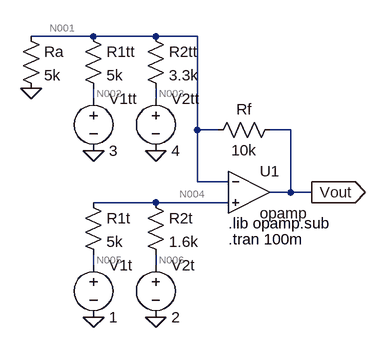
[diagram p0: schematic opamp_alg2.asc]
opamp_alg2.asc, the LTspice schematic file:
Version 4.1
SHEET 1 880 680
WIRE -32 -64 -128 -64
WIRE 64 -64 -32 -64
WIRE 128 -64 64 -64
WIRE -32 32 -32 16
WIRE 64 32 64 16
WIRE 128 80 128 -64
WIRE 160 80 128 80
WIRE 272 80 240 80
WIRE 128 160 128 80
WIRE 176 160 128 160
WIRE 272 176 272 80
WIRE 272 176 240 176
WIRE 304 176 272 176
WIRE 64 192 -32 192
WIRE 176 192 64 192
WIRE -32 288 -32 272
WIRE 64 288 64 272
FLAG 304 176 Vout
IOPIN 304 176 Out
FLAG -32 368 0
FLAG 64 368 0
FLAG -32 112 0
FLAG 64 112 0
FLAG -128 16 0
SYMBOL OpAmps\\opamp 208 112 R0
SYMATTR InstName U1
SYMBOL res 256 64 R90
WINDOW 0 0 56 VBottom 2
WINDOW 3 32 56 VTop 2
SYMATTR InstName Rf
SYMATTR Value 10k
SYMBOL res 48 -80 R0
SYMATTR InstName R2tt
SYMATTR Value 3.3k
SYMBOL res -48 -80 R0
SYMATTR InstName R1tt
SYMATTR Value 5k
SYMBOL res -48 176 R0
SYMATTR InstName R1t
SYMATTR Value 5k
SYMBOL res 48 176 R0
SYMATTR InstName R2t
SYMATTR Value 1.6k
SYMBOL voltage -32 272 R0
SYMATTR InstName V1t
SYMATTR Value 1
SYMBOL voltage 64 272 R0
SYMATTR InstName V2t
SYMATTR Value 2
SYMBOL voltage -32 16 R0
SYMATTR InstName V1tt
SYMATTR Value 3
SYMBOL voltage 64 16 R0
WINDOW 123 0 0 Left 0
WINDOW 39 0 0 Left 0
SYMATTR InstName V2tt
SYMATTR Value 4
SYMBOL res -144 -80 R0
SYMATTR InstName Ra
SYMATTR Value 5k
TEXT 176 224 Left 2 !.lib opamp.sub
TEXT 176 248 Left 2 !.tran 100m

The netlist it stands for:
* opamp_alg2.asc
X§U1 N001 N004 Vout opamp Aol=100K GBW=10Meg  ; pins invin noninvin out
Rf Vout N001 10k
R2tt N001 N003 3.3k
R1tt N001 N002 5k
R1t N004 N005 5k
R2t N004 N006 1.6k
V1t N005 0 1
V2t N006 0 2
V1tt N002 0 3
V2tt N003 0 4
Ra N001 0 5k
.lib opamp.sub
.tran 100m
.backanno
.end

* Results of the author's LTspice run, read from the files saved beside the schematic
* Operating Point, zero values left out:
*   V(n001) = 1.758 V
*   V(n002) = 3 V
*   V(n003) = 4 V
*   V(n004) = 1.758 V
*   V(n005) = 1 V
*   V(n006) = 2 V
*   V(vout) = -4.007 V
*   I(R1t) = 151.5 µA
*   I(R1tt) = -248.5 µA
*   I(R2t) = -151.5 µA
*   I(R2tt) = -679.5 µA
*   I(Ra) = 351.5 µA
*   I(Rf) = -576.5 µA
*   I(V1t) = 151.5 µA
*   I(V1tt) = -248.5 µA
*   I(V2t) = -151.5 µA
*   I(V2tt) = -679.5 µA
*   Ix(u1:3) = 576.5 µA